# Altium schematic sheet MASTER.SchDoc
size A
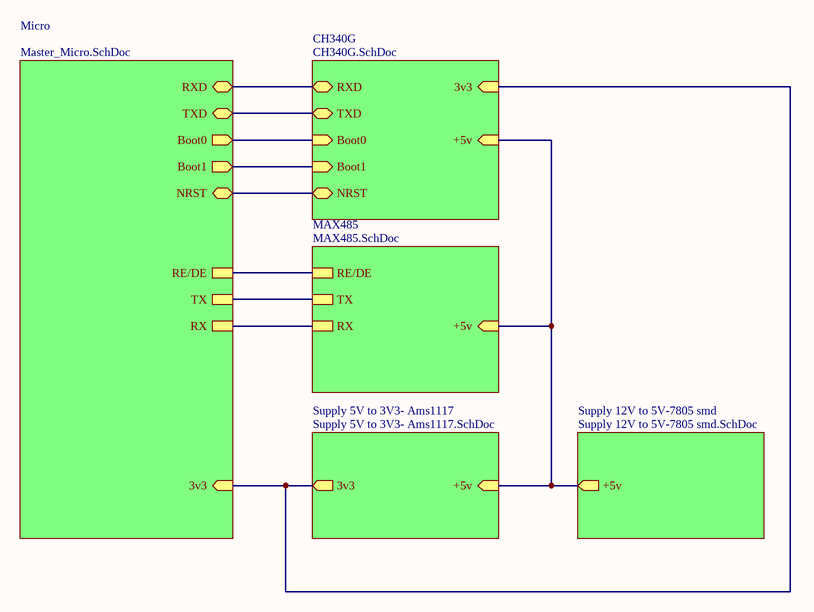
[diagram p0: MASTER.SchDoc]

## Sub-sheets
CH340G = CH340G.SchDoc: +5v (in), RXD (bidir), TXD (bidir), NRST (bidir), Boot0 (in), Boot1 (in), 3v3 (in)
MAX485 = MAX485.SchDoc: +5v (in), RE/DE, TX, RX
Micro = Master_Micro.SchDoc: NRST (bidir), 3v3 (in), TX, RX, RE/DE, RXD (bidir), TXD (bidir), Boot0 (out), Boot1 (out)
Supply 5V to 3V3- Ams1117 = Supply 5V to 3V3- Ams1117.SchDoc: +5v (in), 3v3 (out)
Supply 12V to 5V-7805 smd = Supply 12V to 5V-7805 smd.SchDoc: +5v (out)

## Nets
(unnamed): sheet Micro/NRST, sheet CH340G/NRST
(unnamed): sheet Micro/3v3, sheet Supply 5V to 3V3- Ams1117/3v3, sheet CH340G/3v3
(unnamed): sheet Micro/TX, sheet MAX485/TX
(unnamed): sheet Micro/RX, sheet MAX485/RX
(unnamed): sheet Micro/RE/DE, sheet MAX485/RE/DE
(unnamed): sheet Micro/RXD, sheet CH340G/RXD
(unnamed): sheet Micro/TXD, sheet CH340G/TXD
(unnamed): sheet Micro/Boot0, sheet CH340G/Boot0
(unnamed): sheet Micro/Boot1, sheet CH340G/Boot1
(unnamed): sheet Supply 5V to 3V3- Ams1117/+5v, sheet Supply 12V to 5V-7805 smd/+5v, sheet CH340G/+5v, sheet MAX485/+5v